# EAGLE design LV8712bob (EAGLE 5.07)
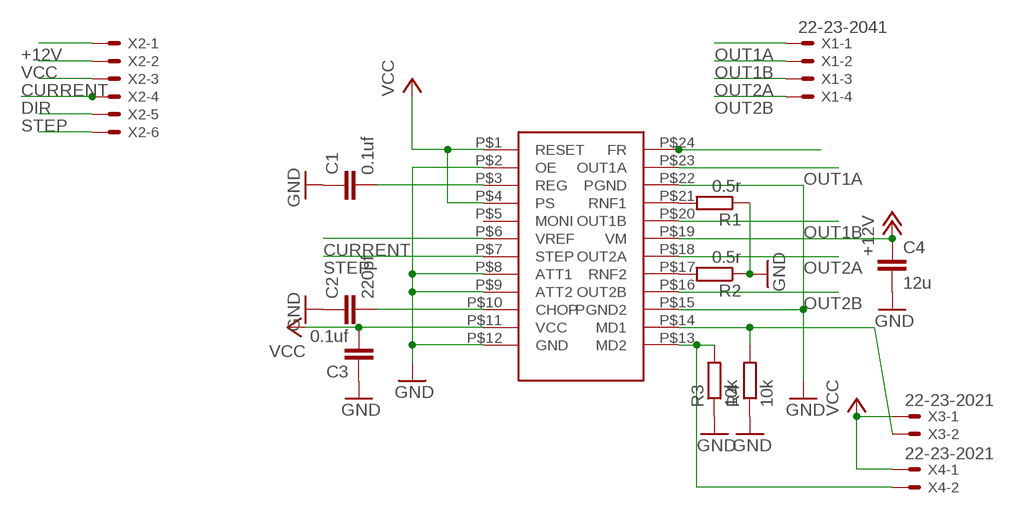
[diagram p0: schematic, sheet 1]

## Parts
C1  0.1uf  C-EUC1206  [C1206]
C2  220pf  C-EUC1206  [C1206]
C3  0.1uf  C-EUC1206  [C1206]
C4  12u  C-EU025-060X050  [C025-060X050]
R1  0.5r  R-EU_M1206  [M1206]
R2  0.5r  R-EU_M1206  [M1206]
R3  10k  R-EU_M1206  [M1206]
R4  10k  R-EU_M1206  [M1206]
U$1  LV8712T  [HTSSOP24]
X1  22-23-2041  [22-23-2041]
X2  22-23-2061  [22-23-2061]
X3  22-23-2021  [22-23-2021]
X4  22-23-2021  [22-23-2021]

## Nets
+12V: C4.1 U$1.P$19(VM) X2.1
CURRENT: U$1.P$6(VREF) X2.3
DIR: U$1.P$24(FR) X2.4
GND: C1.1 C2.1 C3.1 C4.2 R1.1 R2.1 R3.1 R4.1 U$1.P$2(OE) U$1.P$8(ATT1) U$1.P$9(ATT2) U$1.P$12(GND) U$1.P$15(PGND2) U$1.P$22(PGND)
N$1: C2.2 U$1.P$10(CHOP)
N$2: R3.2 U$1.P$13(MD2) X4.2
N$4: C1.2 U$1.P$3(REG)
N$5: R4.2 U$1.P$14(MD1) X3.2
N$7: R1.2 U$1.P$21(RNF1)
N$8: R2.2 U$1.P$17(RNF2)
N$16: X2.6
OUT1A: U$1.P$23(OUT1A) X1.1
OUT1B: U$1.P$20(OUT1B) X1.2
OUT2A: U$1.P$18(OUT2A) X1.3
OUT2B: U$1.P$16(OUT2B) X1.4
STEP: U$1.P$7(STEP) X2.5
VCC: C3.2 U$1.P$1(RESET) U$1.P$4(PS) U$1.P$11(VCC) X2.2 X3.1 X4.1
Unconnected: U$1.P$5(MONI)

## Library data of the parts
C1-C4 = matt rcl:C-EU: CAPACITOR, European symbol
R1-R4 = matt rcl:R-EU_: RESISTOR, European symbol
U$1 = matt:LV8712T
X1 = con-molex:22-23-2041: .100" (2.54mm) Center Header - 4 Pin
X2 = con-molex:22-23-2061: .100" (2.54mm) Center Header - 6 Pin
X3 X4 = con-molex:22-23-2021: .100" (2.54mm) Center Header - 2 Pin

## Board
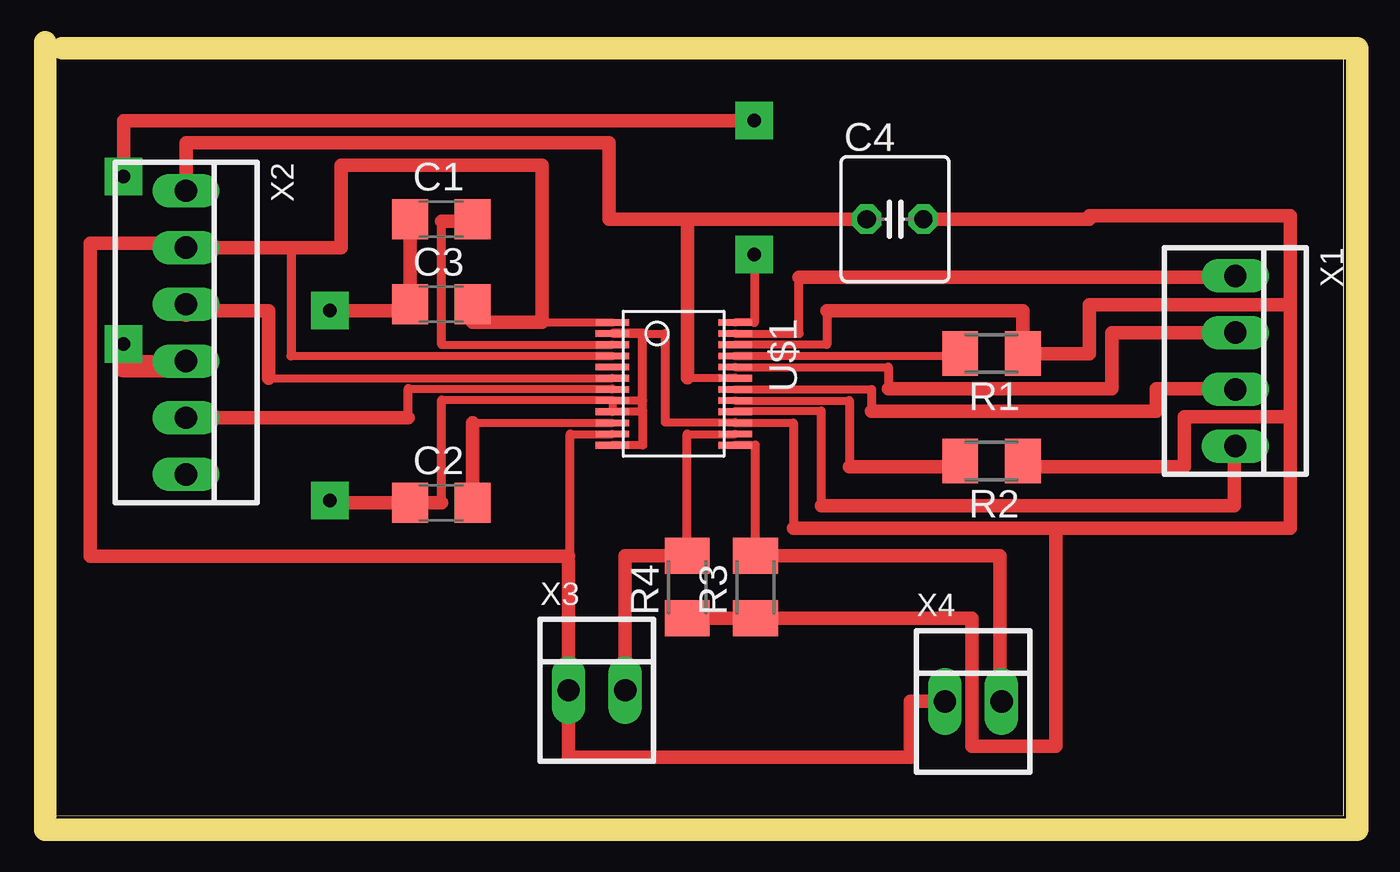
[diagram p1: board, top side]
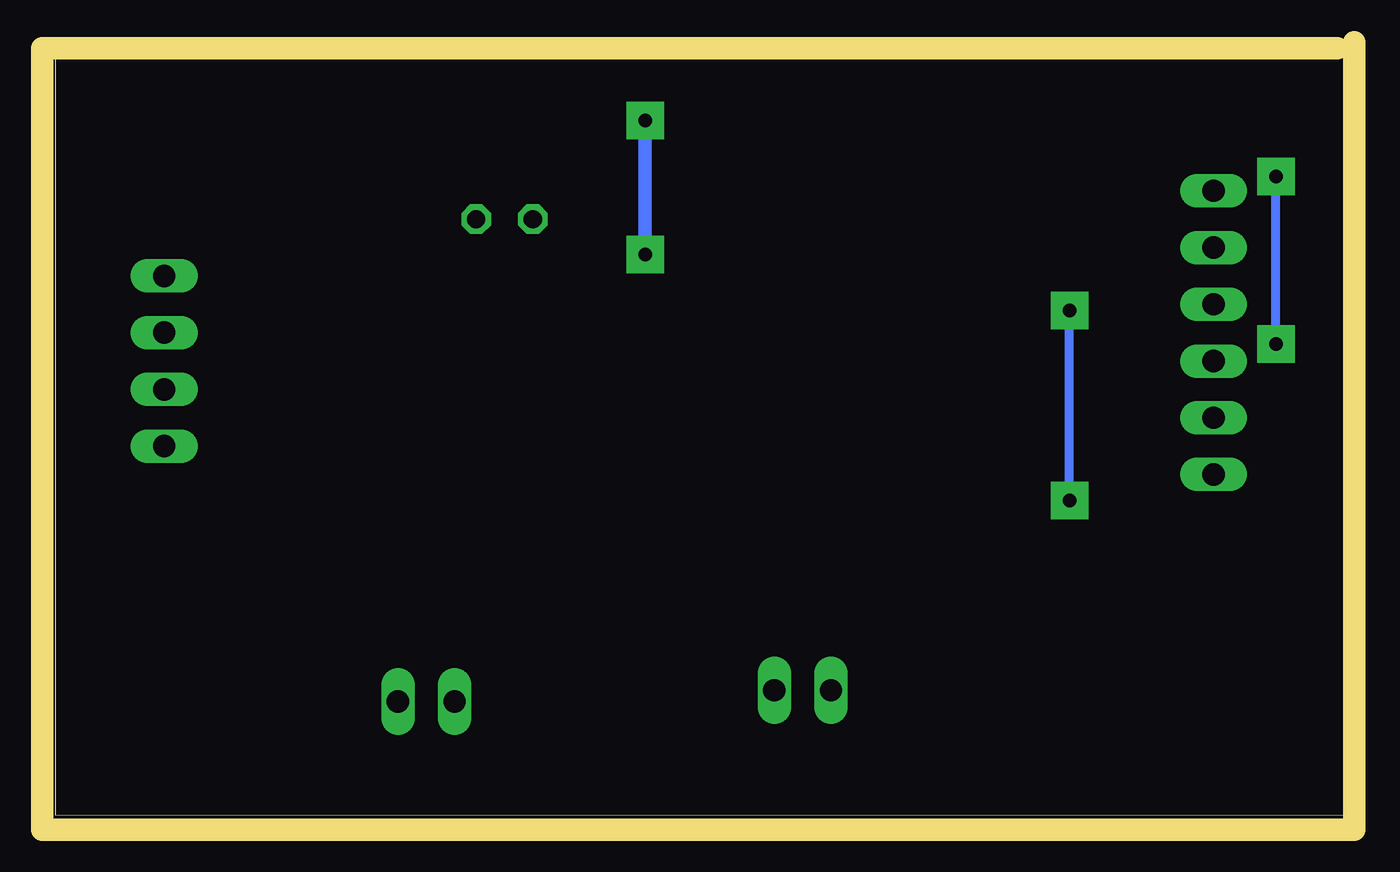
[diagram p2: board, bottom side, seen from below]

Size 57.67 x 34.02 mm. Coordinates in mm from the lower left corner, seen from the top.
Outline: 0,0 57.67,0.02 57.67,34.02 0,34 0,0
Copper layers (1*16): Top 0.035mm / dielectric 1.5mm / Bottom 0.035mm
Design rules "default": minimum track width 10mil, minimum drill 24mil, track to track 8mil, track to pad 8mil, pad to pad 8mil, via to via 8mil, smd to smd 8mil, copper to edge 40mil, drill to drill 8mil, minimum pad ring 10mil, minimum via ring 8mil, stop-mask expansion 4mil, vias tented up to drill 0mil, thermal gap 10mil
Milling: 4 lines

### Footprints (pad centres in the part's own frame; a part is rotated, then mirrored left to right if it is on the bottom)
C1206 = smd 1.6 x 1.8: 1 -1.4,0; 2 1.4,0
C025-060X050 = drill 0.813 octagon: 1 -1.27,0; 2 1.27,0
M1206 = smd 1.6 x 2: 1 -1.4,0; 2 1.4,0
HTSSOP24 = smd 0.3 x 1.5: P$1 -3,-2.5; P$2 -2.5,-2.5; P$3 -2,-2.5; P$4 -1.5,-2.5; P$5 -1,-2.5; P$6 -0.5,-2.5; P$7 0,-2.5; P$8 0.5,-2.5; P$9 1,-2.5; P$10 1.5,-2.5; P$11 2,-2.5; P$12 2.5,-2.5; P$13 2.5,3; P$14 2,3; P$15 1.5,3; P$16 1,3; P$17 0.5,3; P$18 0,3; P$19 -0.5,3; P$20 -1,3; P$21 -1.5,3; P$22 -2,3; P$23 -2.5,3; P$24 -3,3
22-23-2041 = drill 1 long: 1 -3.81,0; 2 -1.27,0; 3 1.27,0; 4 3.81,0
22-23-2061 = drill 1 long: 1 -6.35,0; 2 -3.81,0; 3 -1.27,0; 4 1.27,0; 5 3.81,0; 6 6.35,0
22-23-2021 = drill 1 long: 1 -1.27,0; 2 1.27,0

### Placement (x,y rotation side)
C1  17.26,26.71 0 top
C2  17.26,14.01 0 top
C3  17.26,22.9 0 top
C4  37.58,26.71 0 top
R1  41.9,20.69 180 top
R2  41.9,15.88 180 top
R3  31.33,10.24 90 top
R4  28.27,10.24 90 top
U$1  27.42,19.09 270 top
X1  52.82,20.36 270 top
X2  5.83,21.63 270 top
X3  24.23,5.62 0 top
X4  41.08,5.12 0 top

### Tracks (layer width: path | path; a pad name or v marks a point on that pad's centre or on a via)
+12V
  Top 0.35: 28.28,19.62 30.42,19.62 U$1.P$19
  Top 0.6: X2.1 5.83,30.12 24.78,30.12 24.78,26.71 C4.1 28.28,26.71 28.28,19.62
CURRENT
  Top 0.35: 9.53,19.59 U$1.P$6
  Top 0.6: 9.53,19.59 9.53,22.62 5.83,22.62
  Top 1: X2.3 5.83,22.62
DIR  (via drill 0.6 pad 1.68)
  Top 0.35: 31.28,22.09 U$1.P$24
  Top 0.406: v31.28,25.12 31.28,22.09 | 5.83,20.12 X2.4
  Top 0.6: v31.28,31.12 3.03,31.12 v3.03,28.62
  Top 1: 5.83,20.12 3.03,20.12 v3.03,21.12
  Bottom 0.406: v3.03,21.12 v3.03,28.62
  Bottom 0.6: v31.28,31.12 v31.28,25.12
GND  (via drill 0.6 pad 1.68)
  Top 0.35: 26.28,16.59 U$1.P$12 | 24.92,18.12 26.28,18.12 | 26.28,18.59 U$1.P$8 | 26.28,21.62 24.92,21.62 U$1.P$2 27.28,21.59 | 34.53,21.09 U$1.P$22 | 33.03,17.59 U$1.P$15 30.42,17.62 27.28,17.62 | 17.28,18.62 24.92,18.62 U$1.P$9
  Top 0.406: 26.28,16.59 26.28,18.12 26.28,18.59 26.28,21.62 | U$1.P$9 24.92,18.12 | 43.3,15.62 R2.1 | 46.28,26.87 46.28,26.71 | 34.53,22.62 34.53,21.09 | 33.03,17.59 33.03,12.87 | 15.86,22.62 C3.1 | 27.28,21.59 27.28,17.62 | 17.28,14.01 17.28,18.62 | 12.28,14.01 v12.28,14.12
  Top 0.6: R4.1 R3.1 41.03,8.84 41.03,3.12 44.78,3.12 44.78,12.87 | 55.28,22.87 46.28,22.87 46.28,20.69 R1.1 43.3,22.62 34.53,22.62 | 55.28,17.87 55.28,22.87 | 55.28,17.87 50.53,17.87 50.53,15.62 43.3,15.62 | 46.28,26.71 C4.2 | 46.28,26.87 55.28,26.87 55.28,22.87 | 33.03,12.87 44.78,12.87 | 44.78,12.87 55.28,12.87 55.28,17.87 | C3.1 C1.1 | v12.28,22.62 15.86,22.62 | 17.28,14.01 C2.1 12.28,14.01
  Bottom 0.406: v12.28,14.12 v12.28,22.62 12.28,22.9
N$1
  Top 0.35: 18.66,17.59 U$1.P$10
  Top 0.6: C2.2 18.66,17.59
N$2
  Top 0.35: 31.33,16.59 U$1.P$13
  Top 0.4: R3.2 31.33,16.59
  Top 0.406: 42.28,4.62 42.35,4.62 X4.2
  Top 0.6: R3.2 42.28,11.64 42.28,4.62
N$4
  Top 0.35: 17.28,21.09 U$1.P$3
  Top 0.406: 17.28,21.09 17.28,26.62 | 18.66,26.62 C1.2
  Top 0.6: 17.28,26.62 18.66,26.62
N$5
  Top 0.35: 28.27,17.09 U$1.P$14
  Top 0.406: R4.2 28.27,17.09
  Top 0.6: R4.2 25.5,11.64 X3.2
N$7
  Top 0.35: U$1.P$21 40.5,20.59
  Top 0.406: 40.5,20.59 R1.2
N$8
  Top 0.35: U$1.P$17 35.53,18.59
  Top 0.406: 35.53,18.59 35.53,15.62 | 40.5,15.62 R2.2
  Top 0.6: 35.53,15.62 40.5,15.62
OUT1A
  Top 0.35: U$1.P$23 33.28,21.59
  Top 0.406: 33.28,21.59 33.28,24.12 | 52.82,24.12 X1.1
  Top 0.6: 33.28,24.12 52.82,24.12
OUT1B
  Top 0.35: U$1.P$20 37.28,20.09
  Top 0.406: 37.28,20.09 37.28,19.12 | X1.2
  Top 0.6: 37.28,19.12 47.28,19.12 47.28,21.62 X1.2
OUT2A
  Top 0.35: U$1.P$18 36.53,19.09
  Top 0.406: 36.53,19.09 36.53,18.12 | 52.82,19.12 X1.3
  Top 0.6: 36.53,18.12 49.28,18.12 49.28,19.12 52.82,19.12
OUT2B
  Top 0.35: 34.28,18.12 30.42,18.12 U$1.P$16
  Top 0.406: 52.78,16.55 X1.4 | 34.28,13.87 34.28,18.12
  Top 0.6: 52.78,16.55 52.78,13.87 34.28,13.87
STEP
  Top 0.35: 15.78,19.12 24.92,19.12 U$1.P$7
  Top 0.406: 15.78,17.82 15.78,19.12
  Top 0.6: X2.5 15.78,17.82
VCC
  Top 0.35: 23.03,17.09 U$1.P$11 | 21.78,22.09 U$1.P$1 | 10.53,20.59 U$1.P$4
  Top 0.406: 23.03,17.09 23.03,11.62 22.96,11.62 | 18.66,22.09 C3.2 | 5.83,25.62 X2.2 | 10.53,25.44 10.53,20.59
  Top 0.5: 22.96,11.62 22.96,11.37
  Top 0.6: 18.66,22.09 21.78,22.09 21.78,29.12 12.78,29.12 12.78,25.44 10.53,25.44 X2.2 | X4.1 38.28,5.12 38.28,2.62 22.96,2.62 X3.1 22.96,11.37 | 5.83,25.62 1.53,25.62 1.53,11.62 22.96,11.62